# Altium schematic sheet Sheet1.SchDoc
size A4
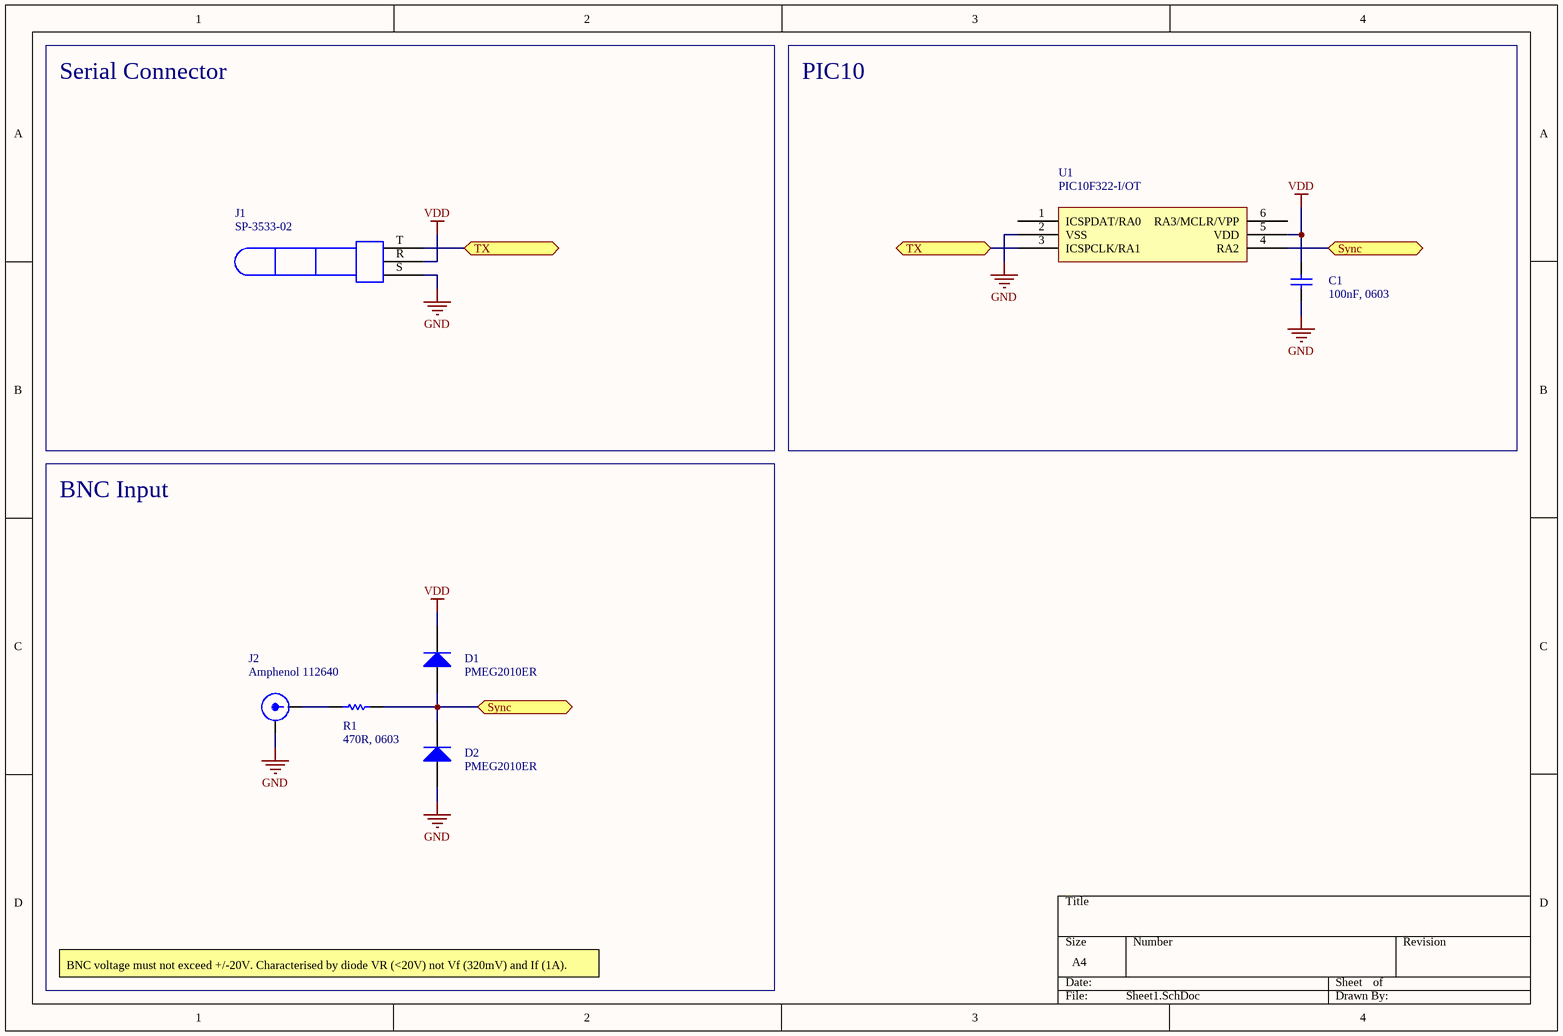
[diagram p0: Sheet1.SchDoc]

## Parts
C1  100nF, 0603  [Capacitor 0603]
D1  PMEG2010ER  [SOD-123]
D2  PMEG2010ER  [SOD-123]
J1  SP-3533-02  [SP-3533-02]
J2  Amphenol 112640  [Amphenol 112640]
R1  470R, 0603  [Resistor 0603]
U1  PIC10F322-I/OT  [SOT-23-6]

## Blocks framed on the sheet
Serial Connector: J1
PIC10: C1 U1
BNC Input: D1 D2 J2 R1

## Ports
Sync, TX

## Nets
GND: C1.1 D2.A J1.S J2.Shield U1.2(VSS)
VDD: C1.2 D1.K J1.R U1.5(VDD)
Sync: D1.A D2.K R1.2 U1.4(RA2) ; port Sync
TX: J1.T U1.3(ICSPCLK/RA1) ; port TX
NetJ2_Signal: J2.Signal R1.1

Not connected (* = marked no-connect by the designer): U1 1(ICSPDAT/RA0) 6(RA3/MCLR/VPP)

## Notes on the sheet
- BNC voltage must not exceed +/-20V. Characterised by diode VR (<20V) not Vf (320mV) and If (1A).

## Library data of the parts
C1 = Capacitor
D1 D2 = Diode
J2 = BNC
R1 = Resistor